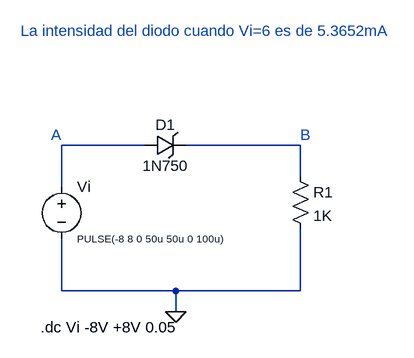
[diagram p0: schematic 1.1.3.b.asc]
1.1.3.b.asc, the LTspice schematic file:
Version 4
SHEET 1 1360 680
WIRE 128 -112 0 -112
WIRE 368 -112 192 -112
WIRE 368 -64 368 -112
WIRE 0 -48 0 -112
WIRE 0 112 0 32
WIRE 176 112 0 112
WIRE 368 112 368 16
WIRE 368 112 176 112
WIRE 176 144 176 112
FLAG 176 144 0
SYMBOL zener 128 -128 M90
WINDOW 0 0 32 VBottom 2
WINDOW 3 32 32 VTop 2
SYMATTR InstName D1
SYMATTR Value 1N750
SYMATTR Description Diode
SYMATTR Type diode
SYMBOL res 352 -80 R0
SYMATTR InstName R1
SYMATTR Value 1K
SYMBOL voltage 0 -64 R0
WINDOW 123 24 124 Left 2
WINDOW 39 0 0 Left 0
WINDOW 3 24 96 Left 1
SYMATTR Value PULSE(-8 8 0 50u 50u 0 100u)
SYMATTR InstName Vi
TEXT -32 168 Left 2 !.dc Vi -8V +8V 0.05
TEXT -16 -128 Left 2 ;A
TEXT 368 -128 Left 2 ;B
TEXT 224 -288 Center 2 ;La intensidad del diodo cuando Vi=6 es de 5.3652mA

The netlist it stands for:
* 1.1.3.b.asc
D1 N001 N002 1N750
R1 N002 0 1K
Vi N001 0 PULSE(-8 8 0 50u 50u 0 100u)
.model D D
.lib standard.dio
.dc Vi -8V +8V 0.05
* A
* B
* La intensidad del diodo cuando Vi=6 es de 5.3652mA
.backanno
.end

* Results of the author's LTspice run, read from the files saved beside the schematic
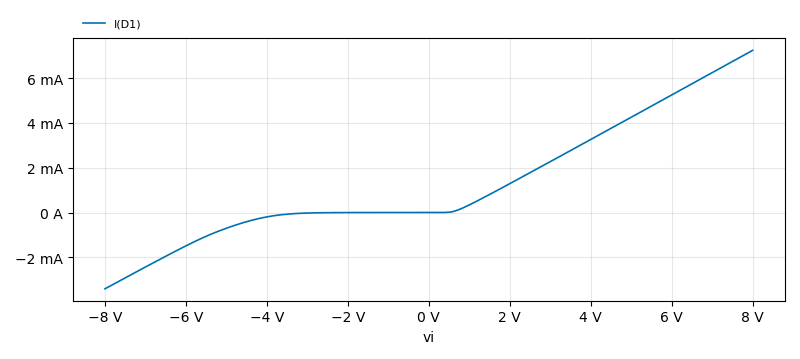
[diagram p1: DC transfer characteristic of 1.1.3.b.asc, plotted from the saved traces]
* DC transfer characteristic, 1 run:
*   I(D1): -3.403 mA at vi=-8 V, 7.234 mA at vi=8 V, min -3.403 mA, max 7.234 mA